# Altium schematic sheet 07_MCU.SchDoc: PSoC6
size A; Revision: A; SheetNumber: 7; SheetTotal: 10; ECE315_Project_Name: ECE453 Processor Mezzanine
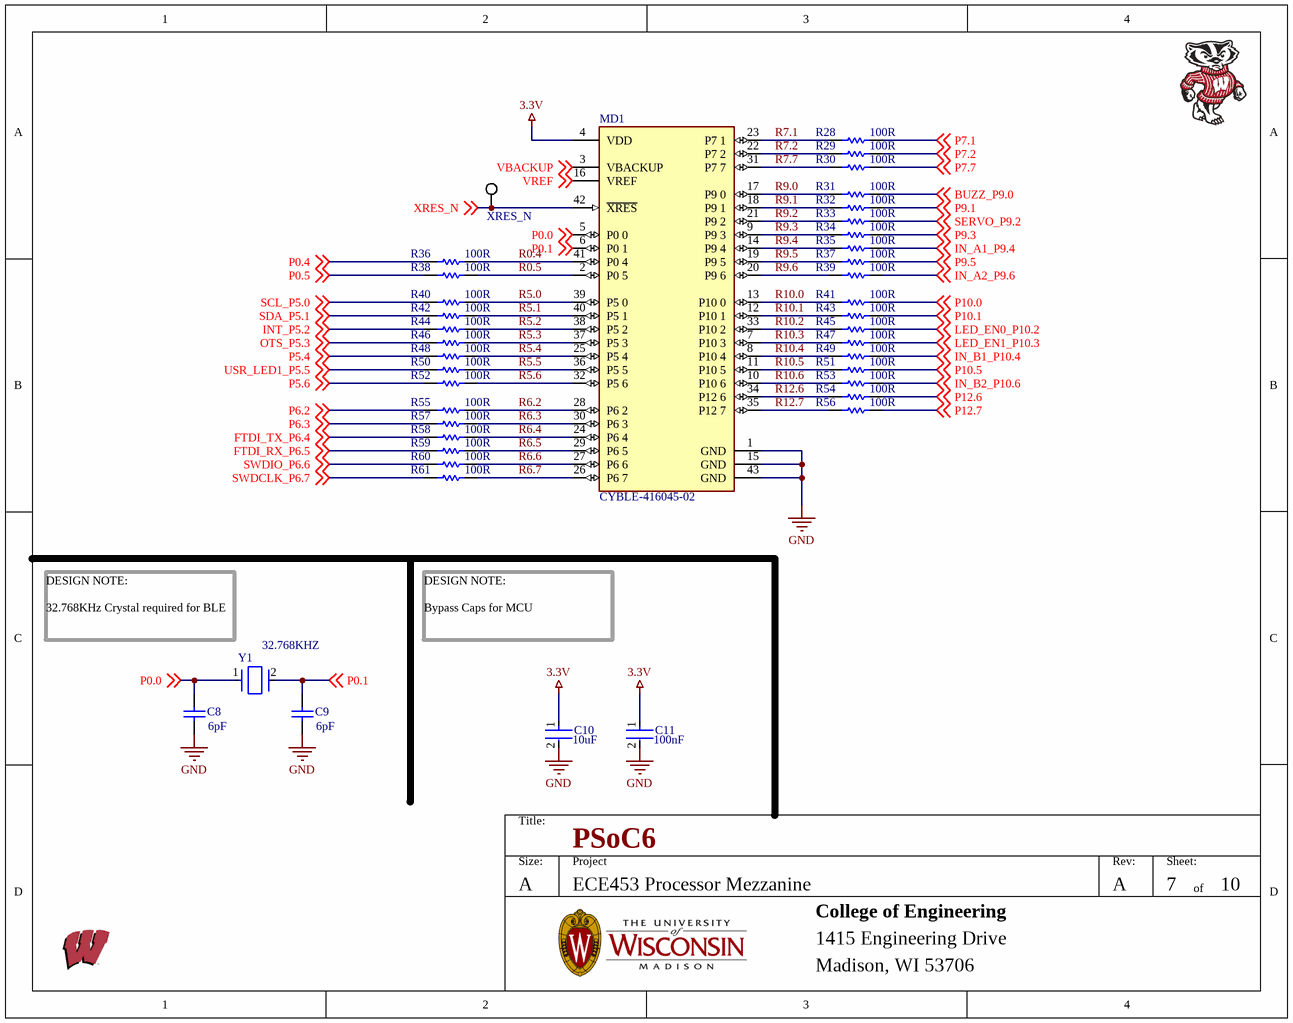
[diagram p0: 07_MCU.SchDoc]

## Parts
C8  value 6pF  [CAPC2013X94X50LL20T25]  (hidden comment: 08055A6R0CAT2A)
C9  value 6pF  [CAPC2013X94X50LL20T25]  (hidden comment: 08055A6R0CAT2A)
C10  value 10uF  [FP-C0805C-DG-MFG]  (hidden comment: C0805C106K8PACTU)
C11  value 100nF  [FP-C0805C-DN-MFG]  (hidden comment: C0805C104K5RACTU)
MD1  CYBLE-416045-02  [FP-CYBLE-416045-02-MFG]  (no BOM)
R28  value 100R  [RESC2013X60X40ML20T25]  (hidden comment: ERA6AEB101V)
R29  value 100R  [RESC2013X60X40ML20T25]  (hidden comment: ERA6AEB101V)
R30  value 100R  [RESC2013X60X40ML20T25]  (hidden comment: ERA6AEB101V)
R31  value 100R  [RESC2013X60X40ML20T25]  (hidden comment: ERA6AEB101V)
R32  value 100R  [RESC2013X60X40ML20T25]  (hidden comment: ERA6AEB101V)
R33  value 100R  [RESC2013X60X40ML20T25]  (hidden comment: ERA6AEB101V)
R34  value 100R  [RESC2013X60X40ML20T25]  (hidden comment: ERA6AEB101V)
R35  value 100R  [RESC2013X60X40ML20T25]  (hidden comment: ERA6AEB101V)
R36  value 100R  [RESC2013X60X40ML20T25]  (hidden comment: ERA6AEB101V)
R37  value 100R  [RESC2013X60X40ML20T25]  (hidden comment: ERA6AEB101V)
R38  value 100R  [RESC2013X60X40ML20T25]  (hidden comment: ERA6AEB101V)
R39  value 100R  [RESC2013X60X40ML20T25]  (hidden comment: ERA6AEB101V)
R40  value 100R  [RESC2013X60X40ML20T25]  (hidden comment: ERA6AEB101V)
R41  value 100R  [RESC2013X60X40ML20T25]  (hidden comment: ERA6AEB101V)
R42  value 100R  [RESC2013X60X40ML20T25]  (hidden comment: ERA6AEB101V)
R43  value 100R  [RESC2013X60X40ML20T25]  (hidden comment: ERA6AEB101V)
R44  value 100R  [RESC2013X60X40ML20T25]  (hidden comment: ERA6AEB101V)
R45  value 100R  [RESC2013X60X40ML20T25]  (hidden comment: ERA6AEB101V)
R46  value 100R  [RESC2013X60X40ML20T25]  (hidden comment: ERA6AEB101V)
R47  value 100R  [RESC2013X60X40ML20T25]  (hidden comment: ERA6AEB101V)
R48  value 100R  [RESC2013X60X40ML20T25]  (hidden comment: ERA6AEB101V)
R49  value 100R  [RESC2013X60X40ML20T25]  (hidden comment: ERA6AEB101V)
R50  value 100R  [RESC2013X60X40ML20T25]  (hidden comment: ERA6AEB101V)
R51  value 100R  [RESC2013X60X40ML20T25]  (hidden comment: ERA6AEB101V)
R52  value 100R  [RESC2013X60X40ML20T25]  (hidden comment: ERA6AEB101V)
R53  value 100R  [RESC2013X60X40ML20T25]  (hidden comment: ERA6AEB101V)
R54  value 100R  [RESC2013X60X40ML20T25]  (hidden comment: ERA6AEB101V)
R55  value 100R  [RESC2013X60X40ML20T25]  (hidden comment: ERA6AEB101V)
R56  value 100R  [RESC2013X60X40ML20T25]  (hidden comment: ERA6AEB101V)
R57  value 100R  [RESC2013X60X40ML20T25]  (hidden comment: ERA6AEB101V)
R58  value 100R  [RESC2013X60X40ML20T25]  (hidden comment: ERA6AEB101V)
R59  value 100R  [RESC2013X60X40ML20T25]  (hidden comment: ERA6AEB101V)
R60  value 100R  [RESC2013X60X40ML20T25]  (hidden comment: ERA6AEB101V)
R61  value 100R  [RESC2013X60X40ML20T25]  (hidden comment: ERA6AEB101V)
XRES_N  5019  [KSTN-5019_V]  (value not drawn)
Y1  32.768KHZ  [FP-ABS07-120-MFG]

## Nets
3.3V: C10.1 C11.1 MD1.4(VDD)
GND: C8.1 C9.1 C10.2 C11.2 MD1.1(GND) MD1.15(GND) MD1.43(GND)
BUZZ_P9.0: R31.2 ; off-sheet BUZZ_P9.0
FTDI_RX_P6.5: R59.1 ; off-sheet FTDI_RX_P6.5
FTDI_TX_P6.4: R58.1 ; off-sheet FTDI_TX_P6.4
IN_A1_P9.4: R35.2 ; off-sheet IN_A1_P9.4
IN_A2_P9.6: R39.2 ; off-sheet IN_A2_P9.6
IN_B1_P10.4: R49.2 ; off-sheet IN_B1_P10.4
IN_B2_P10.6: R53.2 ; off-sheet IN_B2_P10.6
INT_P5.2: R44.1 ; off-sheet INT_P5.2
LED_EN0_P10.2: R45.2 ; off-sheet LED_EN0_P10.2
LED_EN1_P10.3: R47.2 ; off-sheet LED_EN1_P10.3
OTS_P5.3: R46.1 ; off-sheet OTS_P5.3
P0.0: C8.2 MD1.5(P0_0) Y1.1 ; off-sheet P0.0
P0.1: C9.2 MD1.6(P0_1) Y1.2 ; off-sheet P0.1
P0.4: R36.1 ; off-sheet P0.4
P0.5: R38.1 ; off-sheet P0.5
P5.4: R48.1 ; off-sheet P5.4
P5.6: R52.1 ; off-sheet P5.6
P6.2: R55.1 ; off-sheet P6.2
P6.3: R57.1 ; off-sheet P6.3
P7.1: R28.2 ; off-sheet P7.1
P7.2: R29.2 ; off-sheet P7.2
P7.7: R30.2 ; off-sheet P7.7
P9.1: R32.2 ; off-sheet P9.1
P9.3: R34.2 ; off-sheet P9.3
P9.5: R37.2 ; off-sheet P9.5
P10.0: R41.2 ; off-sheet P10.0
P10.1: R43.2 ; off-sheet P10.1
P10.5: R51.2 ; off-sheet P10.5
P12.6: R54.2 ; off-sheet P12.6
P12.7: R56.2 ; off-sheet P12.7
R0.4: MD1.41(P0_4) R36.2
R0.5: MD1.2(P0_5) R38.2
R5.0: MD1.39(P5_0) R40.2
R5.1: MD1.40(P5_1) R42.2
R5.2: MD1.38(P5_2) R44.2
R5.3: MD1.37(P5_3) R46.2
R5.4: MD1.25(P5_4) R48.2
R5.5: MD1.36(P5_5) R50.2
R5.6: MD1.32(P5_6) R52.2
R6.2: MD1.28(P6_2) R55.2
R6.3: MD1.30(P6_3) R57.2
R6.4: MD1.24(P6_4) R58.2
R6.5: MD1.29(P6_5) R59.2
R6.6: MD1.27(P6_6) R60.2
R6.7: MD1.26(P6_7) R61.2
R7.1: MD1.23(P7_1) R28.1
R7.2: MD1.22(P7_2) R29.1
R7.7: MD1.31(P7_7) R30.1
R9.0: MD1.17(P9_0) R31.1
R9.1: MD1.18(P9_1) R32.1
R9.2: MD1.21(P9_2) R33.1
R9.3: MD1.9(P9_3) R34.1
R9.4: MD1.14(P9_4) R35.1
R9.5: MD1.19(P9_5) R37.1
R9.6: MD1.20(P9_6) R39.1
R10.0: MD1.13(P10_0) R41.1
R10.1: MD1.12(P10_1) R43.1
R10.2: MD1.33(P10_2) R45.1
R10.3: MD1.7(P10_3) R47.1
R10.4: MD1.8(P10_4) R49.1
R10.5: MD1.11(P10_5) R51.1
R10.6: MD1.10(P10_6) R53.1
R12.6: MD1.34(P12_6) R54.1
R12.7: MD1.35(P12_7) R56.1
SCL_P5.0: R40.1 ; off-sheet SCL_P5.0
SDA_P5.1: R42.1 ; off-sheet SDA_P5.1
SERVO_P9.2: R33.2 ; off-sheet SERVO_P9.2
SWDCLK_P6.7: R61.1 ; off-sheet SWDCLK_P6.7
SWDIO_P6.6: R60.1 ; off-sheet SWDIO_P6.6
USR_LED1_P5.5: R50.1 ; off-sheet USR_LED1_P5.5
VBACKUP: MD1.3(VBACKUP) ; off-sheet VBACKUP
VREF: MD1.16(VREF) ; off-sheet VREF
XRES_N: MD1.42(~{XRES}) XRES_N.1 ; off-sheet XRES_N

## Notes on the sheet
- (near Y1) DESIGN NOTE:
  32.768KHz Crystal required for BLE
- DESIGN NOTE:
  Bypass Caps for MCU
- Title:
- Size:
- A
- Project
- Rev:
- Sheet:
- of
- College of Engineering
- 1415 Engineering Drive
- Madison, WI 53706

## Library data of the parts
C8 C9 = CMP-2007-04344-1: Manufacturer: KEMET; Manufacturer Part Number: CBR08C609C5GAC; Voltage Rating: 50V; Supplier: Newark; Supplier Part Number: 64AJ3970; RoHS: Yes; Category: Ceramic Capacitors; Stock: 1930; Pricing: 10=0.048, 25=0.048, 50=0.048, 100=0.048, 250=0.048, 500=0.048, 1000=0.048 (USD); Mounting Technology: Surface Mount; Case/Package: 0805; Min Operating Temperature: -55°C; Max Operating Temperature: 125°C; Packaging: Tape and Reel; Package Quantity: 4000; Series: CBR; Length: 0.079inch; Width: 0.049inch; Thickness: 0.035inch; RoHS Compliant: Yes; ComponentLink1URL: https://search.kemet.com/component-edge/download/datasheet/CBR08C609C5GAC.pdf?src-supplier=Digi-Key; ComponentLink1Description: https://search.kemet.com/component-edge/download/datasheet/CBR08C609C5GAC.pdf?src-supplier=Digi-Key
C10 = CMP-2007-03243-2: CAP CER 10UF 10V X5R 0805; Manufacturer: KEMET; Dielectric Material: Ceramic; Tolerance: 10%; Supplier: Newark; Supplier Part Number: 70K9138; Manufacturer Part Number: C0805C106K8PACTU; RoHS: Yes; Category: Ceramic Capacitors; Stock: 186414; Pricing: 1=0.141, 25=0.141, 50=0.141, 100=0.141, 250=0.141, 500=0.141, 1000=0.141 (USD); Mounting Technology: Surface Mount; Case/Package: 0805; Pins: 2; Contact Plating: Tin,Matte; Case Code (Imperial): 0805; Case Code (Metric): 2012; Min Operating Temperature: -55°C; Max Operating Temperature: 85°C; Packaging: Tape and Reel; Dielectric: X5R; Voltage Rating (DC): 10V; Termination: SMD/SMT; Package Quantity: 1; Voltage Rating: 10V; Voltage: 10V; Dissipation Factor: 10%; Series: C; Construction: Flat; Length: 2mm; Width: 0.049inch; Height: 1.25mm; Depth: 1.25mm; Thickness: 0.055inch; Radiation Hardening: No; Reach SVHC Compliant: No; RoHS Compliant: Yes; ComponentLink1URL: https://datasheet.ciiva.com/7842/1732709-7842198.pdf?src-supplier=Element14; ComponentLink1Description: https://datasheet.ciiva.com/7842/1732709-7842198.pdf?src-supplier=Element14
C11 = CMP-2007-00279-2: CAP CER 0.1UF 50V X7R 0805; Manufacturer: KEMET; Tolerance: 10%; Voltage: 500V; ComponentLink2Description: Datasheet; ComponentLink2URL: https://content.kemet.com/datasheets/KEM_C1003_C0G_SMD.pdf; Supplier: Newark; Supplier Part Number: 19C6015; Manufacturer Part Number: C0805C104K5RACTU; RoHS: Yes; Category: Ceramic Capacitors; Stock: 3382390; Pricing: 1=0.024, 25=0.024, 50=0.024, 100=0.024, 250=0.024, 500=0.024, 1000=0.024 (USD); Mounting Technology: Surface Mount,PCB; Case/Package: 0805; Pins: 2; Case Code (Imperial): 0805; Case Code (Metric): 2012; Min Operating Temperature: -55°C; Max Operating Temperature: 125°C; Package Quantity: 4000; Voltage Rating: 50V; Packaging: Tape and Reel; Voltage Rating (DC): 50V; Dielectric: X7R; Termination: SMD/SMT; Series: SMD Comm X7R; Construction: Flat; Length: 2mm; Width: 1.2mm; Height: 0.9mm; Lead Pitch: 0.75mm; Depth: 1.25mm; Radiation Hardening: No; RoHS Compliant: Yes; Reach SVHC Compliant: No; ComponentLink1URL: https://datasheet.ciiva.com/32431/slceramic-chip-condensers-e-32431755.pdf?src-supplier=Distrelec; ComponentLink1Description: https://datasheet.ciiva.com/32431/slceramic-chip-condensers-e-32431755.pdf?src-supplier=Distrelec; ComponentLink3URL: https://datasheet.ciiva.com/28682/1851736-28682232.pdf?src-supplier=Element14; ComponentLink3Description: https://datasheet.ciiva.com/28682/1851736-28682232.pdf?src-supplier=Element14
MD1 = CMP-12964-000002-1: RF TXRX MOD BLUETOOTH TRACE ANT; Manufacturer: Cypress Semiconductor; Manufacturer 1: Cypress; Number Of Gpio: 36; Number Of Adc Channels: 1; Max Supply Voltage: 3.6V; Min Supply Voltage: 1.71V; Data Rate: 2Mbits/s; Receiving Current: 6.7mA; Max Frequency: 2.5GHz; Bandwidth: 100MHz; Transmitting Current: 5.7mA; Interface: I2C,SPI,UART,I2S,Other; Octopart: https://octopart.com/cyble-416045-02-cypress+semiconductor-96386825; Lead Free: Yes; RoHS: TRUE; Device Class L3: Transceivers; Category: UNK; Package: 0; Device Class L2: RF Semiconductors and Devices; Automotive: No; ComponentLink2URL: https://www.cypress.com/file/428336/download; Temperature Range Low: -40°C; Height: 2mm; Device Class L1: Integrated Circuits (ICs); Manufacturer Part Number: CYBLE-416045-02; ComponentLink2Description: Datasheet; Digikey Description: RF TXRX MOD BLUETOOTH TRACE ANT; Temperature: -40°C to +85°C; Temperature Range High: +85°C; Supplier 1: Digi-Key; Supplier Part Number 1: 428-4622-1-ND; Manufacturer Part Number 1: CYBLE-416045-02; Stock 1: 3441; Pricing 1: 1=16.24000, 10=14.69300, 25=13.53280, 100=12.37280, 250=11.59952 (USD); RoHS Compliant: Yes
R28-R61 = CMP-2001-00580-1: Manufacturer: Yageo; Manufacturer Part Number: RC0805FR-07100RL; Power Rating: 125mW; Tolerance: 1%; Voltage Rating: 150V; Temperature Coefficient: 100ppm/°C; Application(s): HIGH RELIABILITY; Supplier: Newark; Supplier Part Number: 98K7775; RoHS: Yes; Category: Chip SMD Resistors; Stock: 1243890; Pricing: 1=0.102, 10=0.026, 25=0.021, 50=0.017, 100=0.013 (USD); Case Code (Imperial): 0805; Case Code (Metric): 2012; Weight: 0.000917oz; Min Operating Temperature: -55°C; Max Operating Temperature: 155°C; Packaging: Cut Tape; Package Quantity: 5000; Termination: SMD/SMT; Type: General Purpose; Series: RC; Technology: THICK FILM; Length: 2mm; Width: 1.25mm; Height: 0.5mm; Lead Free: Lead Free; RoHS Compliant: Yes; ComponentLink1URL: https://datasheet.ciiva.com/7941/1697719-7941680.pdf?src-supplier=Element14; ComponentLink1Description: https://datasheet.ciiva.com/7941/1697719-7941680.pdf?src-supplier=Element14; ComponentLink2URL: https://datasheet.ciiva.com/11808/0900766b8106beab-11808877.pdf?src-supplier=Rs; ComponentLink2Description: https://datasheet.ciiva.com/11808/0900766b8106beab-11808877.pdf?src-supplier=Rs; ComponentLink3URL: https://datasheet.ciiva.com/22747/444164-22747535.pdf?src-supplier=Element14; ComponentLink3Description: https://datasheet.ciiva.com/22747/444164-22747535.pdf?src-supplier=Element14; ComponentLink4URL: https://datasheet.ciiva.com/17082/rc0805-17082697.pdf?src-supplier=Future+Electronics; ComponentLink4Description: https://datasheet.ciiva.com/17082/rc0805-17082697.pdf?src-supplier=Future+Electronics; ComponentLink5URL: https://datasheet.ciiva.com/7941/1686128-7941679.pdf?src-supplier=Element14; ComponentLink5Description: https://datasheet.ciiva.com/7941/1686128-7941679.pdf?src-supplier=Element14; ComponentLink6URL: https://datasheet.ciiva.com/46447/444164-46447562.pdf?src-supplier=Element14; ComponentLink6Description: https://datasheet.ciiva.com/46447/444164-46447562.pdf?src-supplier=Element14; ComponentLink7URL: https://datasheet.ciiva.com/7660/38627-7660797.pdf?src-supplier=Element14; ComponentLink7Description: https://datasheet.ciiva.com/7660/38627-7660797.pdf?src-supplier=Element14
XRES_N = CMP-1672-00008-1: Test Point, 1 Position SMD, RoHS, Tape and Reel; Manufacturer: Keystone Electronics; Plating: Silver; Body Material: Bronze; Supplier: Newark; Supplier Part Number: 59Y8500; Manufacturer Part Number: 5019; RoHS: Yes; Category: Connectors; Stock: 11269; Pricing: 1=0.411, 10=0.389, 25=0.285, 50=0.279, 100=0.273, 250=0.246 (USD); Mounting Technology: Surface Mount,PCB; Pins: 1; Contact Plating: Silver; Contact Material: Bronze; Material: Bronze; Packaging: Tape and Reel; Package Quantity: 1; Termination: SMD/SMT; Series: 5019; Height: 0.09inch; Reach SVHC Compliant: No; RoHS Compliant: Yes; Lead Free: Lead Free; ComponentLink1URL: https://datasheet.ciiva.com/14848/m60-2p61-14848437.pdf?src-supplier=Digi-Key; ComponentLink1Description: https://datasheet.ciiva.com/14848/m60-2p61-14848437.pdf?src-supplier=Digi-Key; ComponentLink2URL: https://datasheet.ciiva.com/14848/m60-2p61-14848438.pdf?src-supplier=Digi-Key; ComponentLink2Description: https://datasheet.ciiva.com/14848/m60-2p61-14848438.pdf?src-supplier=Digi-Key; ComponentLink3URL: https://datasheet.ciiva.com/14848/m60-2p61-14848439.pdf?src-supplier=Digi-Key; ComponentLink3Description: https://datasheet.ciiva.com/14848/m60-2p61-14848439.pdf?src-supplier=Digi-Key; ComponentLink4URL: https://datasheet.ciiva.com/16318/m60-2p61-16318395.pdf?src-supplier=Future+Electronics; ComponentLink4Description: https://datasheet.ciiva.com/16318/m60-2p61-16318395.pdf?src-supplier=Future+Electronics; ComponentLink5URL: https://datasheet.ciiva.com/16885/70182998-16885945.pdf?src-supplier=Allied+Electronics; ComponentLink5Description: https://datasheet.ciiva.com/16885/70182998-16885945.pdf?src-supplier=Allied+Electronics
Y1 = CMP-2000-07587-2: CRYSTAL 32.7680KHZ 6PF SMD; Manufacturer: Abracon; Manufacturer Part Number: ABS07-120-32.768KHZ-T; Tolerance: 20ppm; ESR (Equivalent Series Resistance): 55kR; ESR: 60kR; Supplier: Newark; Supplier Part Number: 56AC7523; RoHS: Yes; Category: Crystals; Stock: 20747; Pricing: 1=0.587, 25=0.587, 50=0.587, 100=0.587, 250=0.587, 500=0.587, 1000=0.532 (USD); Mounting Technology: Surface Mount; Case/Package: SMD/SMT; Pins: 2; Min Operating Temperature: -40°C; Max Operating Temperature: 85°C; Frequency: 32.768kHz; Load Capacitance: 6pF; Frequency Tolerance: 20ppm; Packaging: Tape and Reel; Package Quantity: 3000; Termination: SMD/SMT; Series: ABS07; Operating Frequency: 32.768 kHz; Length: 3.2mm; Width: 1.5mm; Height: 0.9mm; Depth: 1.5mm; Radiation Hardening: No; Reach SVHC Compliant: No; Lead Free: Lead Free; RoHS Compliant: Yes; ComponentLink1URL: https://datasheet.ciiva.com/6728/abs07-120-32-768khz-t-6728893.pdf?src-supplier=Digi-Key; ComponentLink1Description: https://datasheet.ciiva.com/6728/abs07-120-32-768khz-t-6728893.pdf?src-supplier=Digi-Key; ComponentLink2URL: https://datasheet.ciiva.com/12387/abs07-120-32-768khz-t-218607-12387629.pdf?src-supplier=Mouser; ComponentLink2Description: https://datasheet.ciiva.com/12387/abs07-120-32-768khz-t-218607-12387629.pdf?src-supplier=Mouser